# EasyEDA schematic SCH_ymu762-1_2022-05-05.json
TITLE: Sheet_1; REV: 1.0; Date: 2021-11-16; Sheet: 1/1; Company: Your Company
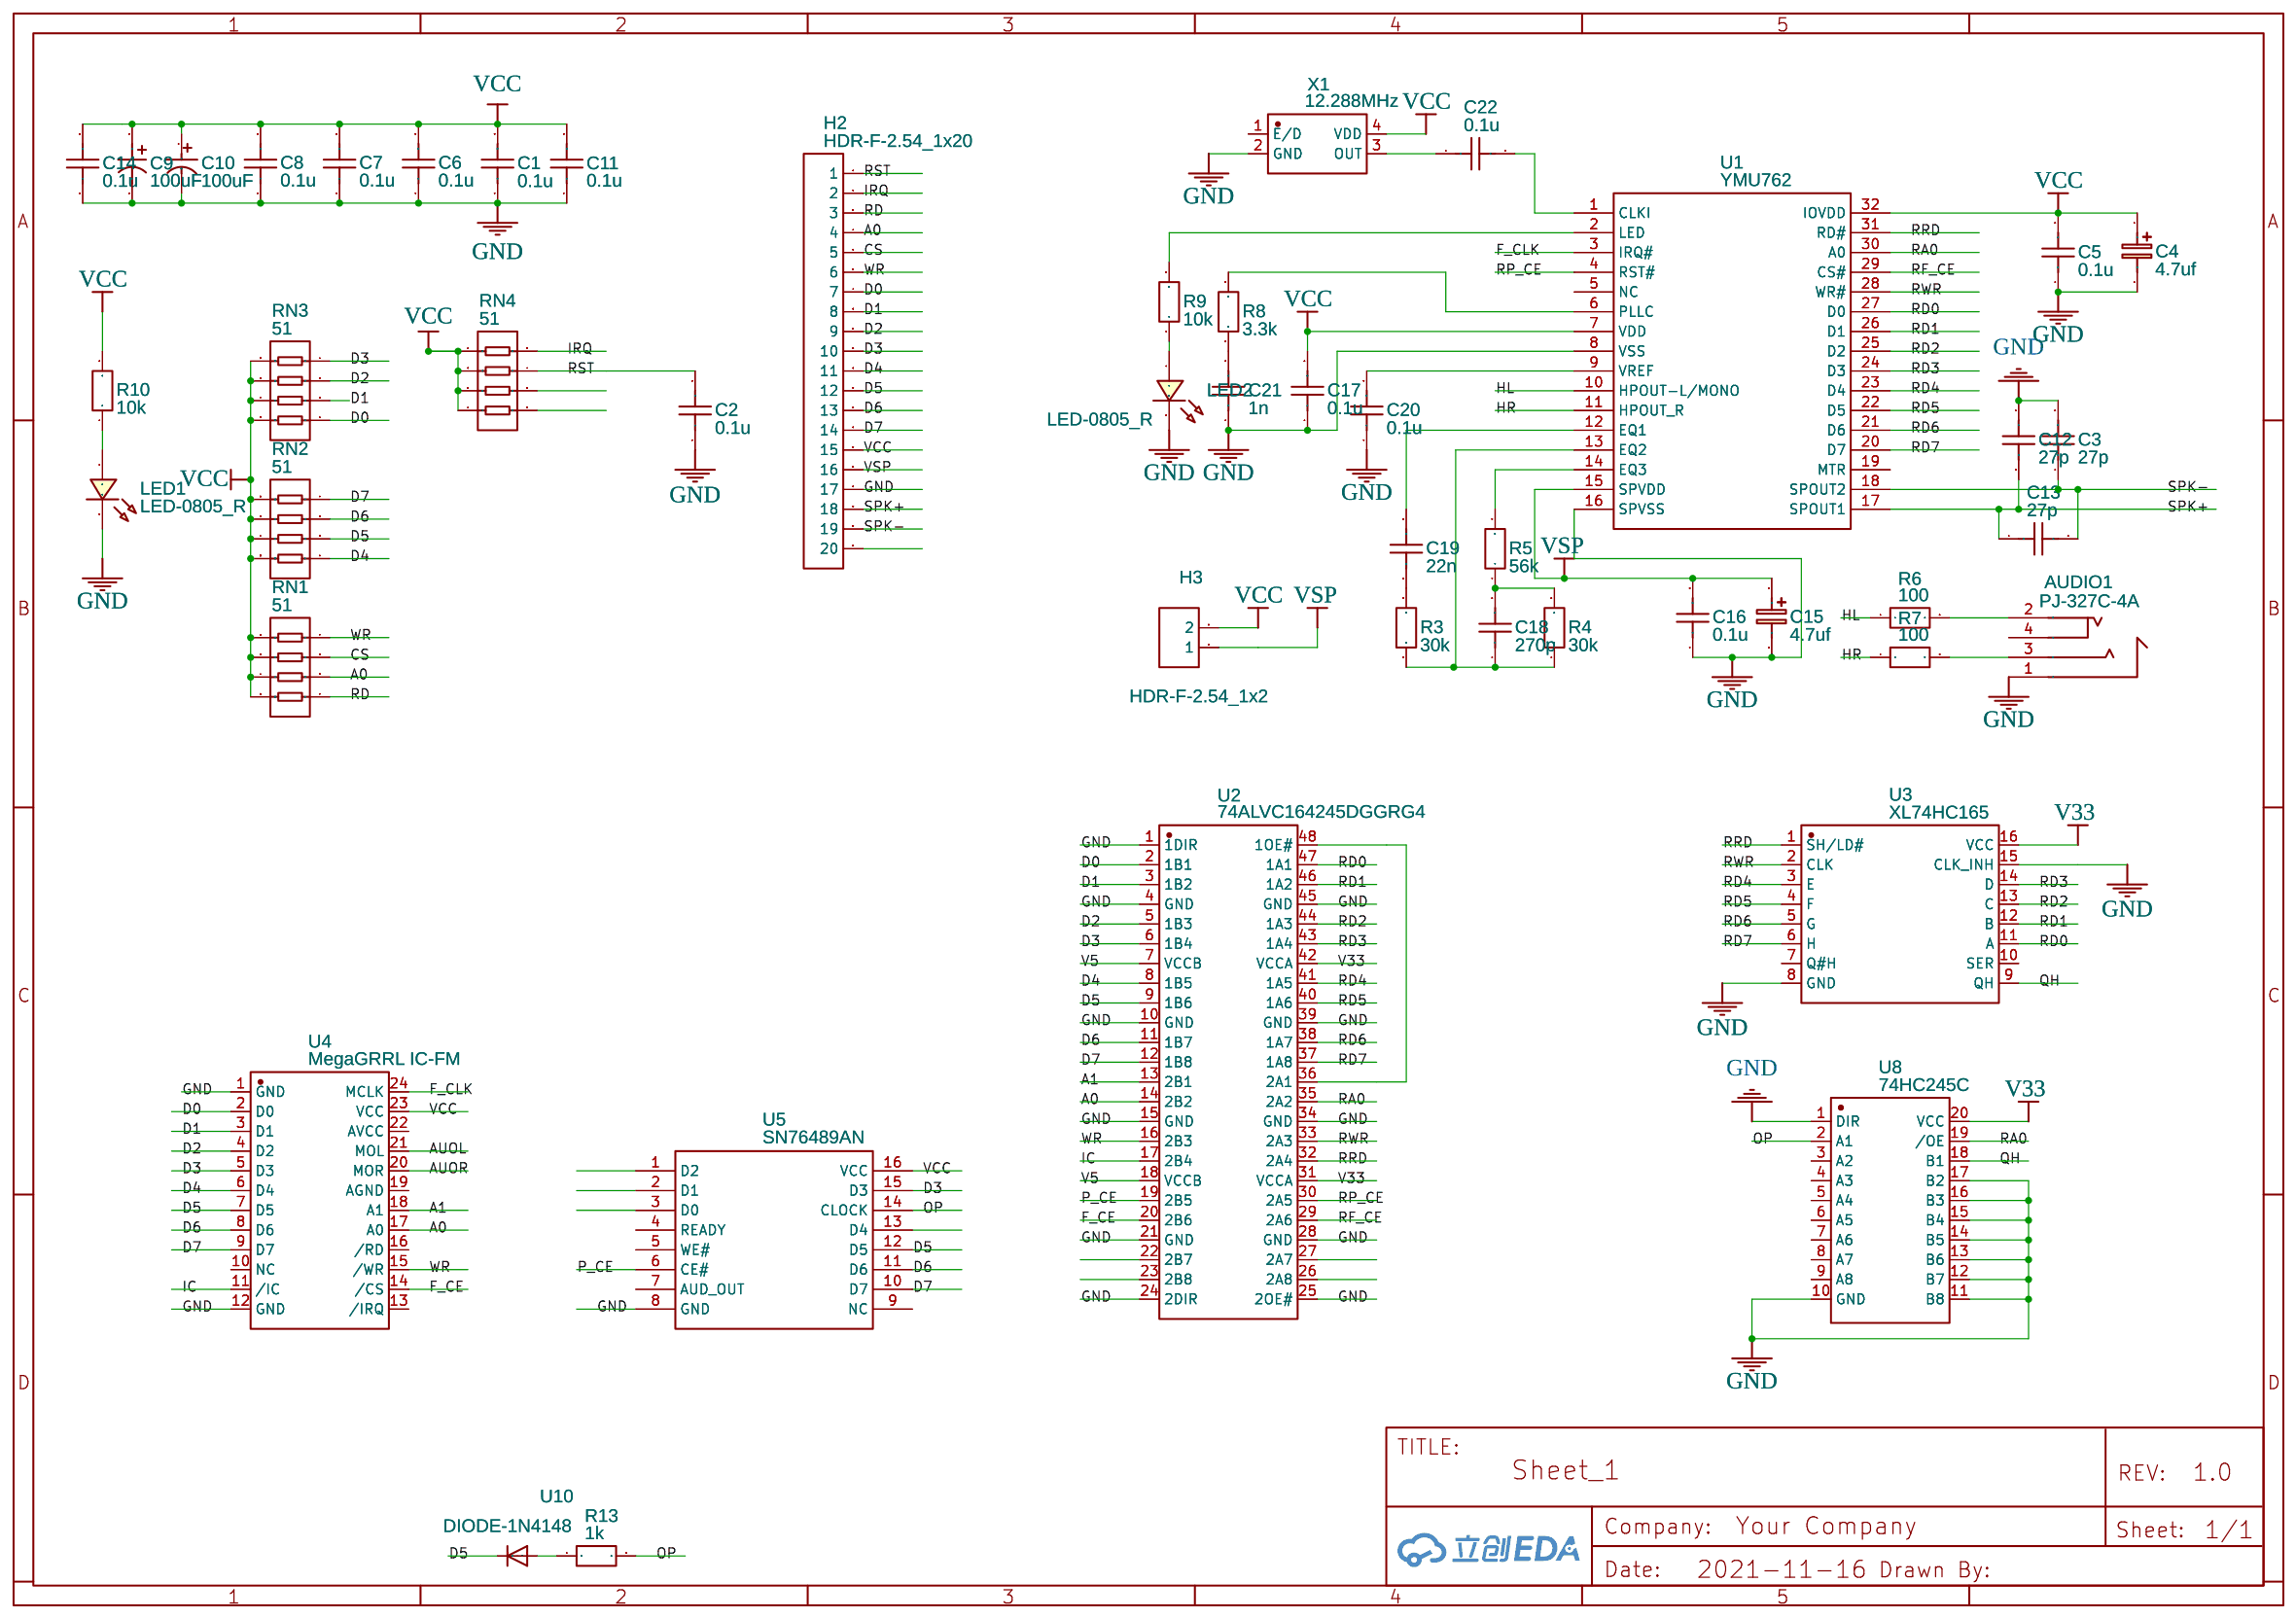
[diagram p0: schematic sheet]

## Parts
AUDIO1  PJ-327C-4A  [AUDIO-SMD_PJ-327C-4A]
C1  0.1u  [C0805]
C2  0.1u  [C0805]
C3  27p  [C0805]
C4  4.7uf  [C1206]
C5  0.1u  [C0805]
C6  0.1u  [C0805]
C7  0.1u  [C0805]
C8  0.1u  [C0805]
C9  100uF  [CAP-SMD_L6.6-W6.6]
C10  100uF  [CAP-TH_BD8.0-P3.50-D0.6-FD]
C11  0.1u  [C0805]
C12  27p  [C0805]
C13  27p  [C0805]
C14  0.1u  [C0805]
C15  4.7uf  [C1206]
C16  0.1u  [C0805]
C17  0.1u  [C0805]
C18  270p  [C0805]
C19  22n  [C0805]
C20  0.1u  [C0805]
C21  1n  [C0805]
C22  0.1u  [C0805]
H2  HDR-F-2.54_1x20  [HDR-F-2.54_1X20]
H3  HDR-F-2.54_1x2  [JP]
LED1  LED-0805_R  [LED0805_RED]
LED2  LED-0805_R  [LED0805_RED]
R3  30k  [R0805]
R4  30k  [R0805]
R5  56k  [R0805]
R6  100  [R0805]
R7  100  [R0805]
R8  3.3k  [R0805]
R9  10k  [R0805]
R10  10k  [R0805]
R13  1k  [R0805]
RN1  51  [RES-ARRAY-SMD_8P-L3.2-W1.6-P0.80-BL-1]
RN2  51  [RES-ARRAY-SMD_8P-L3.2-W1.6-P0.80-BL-1]
RN3  51  [RES-ARRAY-SMD_8P-L3.2-W1.6-P0.80-BL-1]
RN4  51  [RES-ARRAY-SMD_8P-L3.2-W1.6-P0.80-BL-1]
U1  YMU762  [C-PK32QP-2]
U2  74ALVC164245DGGRG4  [TSSOP-48_L12.5-W6.1-P0.50-LS8.1-BL]
U3  XL74HC165  [SOP-16_L9.9-W3.9-P1.27-LS6.1-BL]
U4  MegaGRRL IC-FM  [DIP-24_L32.0-W13.8-P2.54-LS15.6-BL]
U5  SN76489AN  [DIP-16_L20.4-W5.8-P2.54-LS7.6-BL]
U8  74HC245C  [TSSOP-20_L6.5-W4.4-P0.65-LS6.4-BL]
U10  DIODE-1N4148  [LL34-F]
X1  12.288MHz  [OSC-SMD_4P-L7.0-W5.0-BL]

## Library data of the parts
AUDIO1 = PJ-327C-4A: Supplier: LCSC; Manufacturer: HRO; Contributor: LCSC; Supplier Part: C145813
C1-C3 C5-C8 C11-C14 C16-C22 = C_0805_US: Contributor: LCEDA_Lib
C4 C15 = C_Tan_SMD_A_EU: Contributor: LCEDA_Lib
C9 = RVT100UF35V67RV0034: Supplier: LCSC; Supplier Part: C2836442; Manufacturer: KNSCHA(科尼盛); JLCPCB Part Class: Extended Part; Contributor: LCSC
C10 = 63V 100uF 8X12: Supplier: LCSC; Manufacturer: ValuePro; Supplier Part: C2772
H2 = HDR-F-2.54_1x20: Supplier Part: C50984; Supplier: LCSC; Contributor: LCEDA_Lib
H3 = HDR-F-2.54_1x2: Supplier Part: C49661; Supplier: LCSC; Contributor: LCEDA_Lib
LED1 LED2 = LED-0805_R: Manufacturer: EVERLIGHT(台湾亿光); Manufacturer Part: 17-21SURC/S530-A3/TR8; Supplier Part: C72037; Contributor: LCEDA_Lib
R3-R10 R13 = R_0805_EU: Contributor: LCEDA_Lib
RN1-RN4 = YC164-JR-0751RL: Supplier: LCSC; Supplier Part: C13474; Manufacturer: YAGEO; Contributor: LCSC; JLCPCB Part Class: Extended Part
U1 = YMU762: Contributor: re1mu
U2 = 74ALVC164245DGGRG4: Supplier: LCSC; Supplier Part: C2677427; Manufacturer: TI(德州仪器); Contributor: LCSC; JLCPCB Part Class: Extended Part
U3 = XL74HC165: Supplier: LCSC; Supplier Part: C609780; Manufacturer: XINLUDA; Contributor: LCSC; JLCPCB Part Class: Extended Part
U4 = MegaGRRL IC-FM: Supplier Part: C707077; Manufacturer: YAMAHA; Manufacturer Part: YM2612; Contributor: Denjhang; JLCPCB SMD: Yes; SMT Type: Extend
U5 = SN76489AN: Manufacturer: Texas Instruments; Contributor: re1mu
U8 = 74HC245C: Supplier: LCSC; Manufacturer: FM; Supplier Part: C126198; JLCPCB Part Class: Extended Part
U10 = DIODE-1N4148: null
X1 = OT705012.288MJBA4SL: Supplier: LCSC; Supplier Part: C669092; Manufacturer: Yangxing Tech; Contributor: LCSC

## Nets
GND: AUDIO1.1 C1.1 C2.1 C3.2 C4.2 C5.1 C6.1 C7.1 C8.1 C9.2 C10.2 C11.1 C12.1 C14.1 C15.2 C16.1 C17.1 C20.1 C21.1 H2.17 LED1.2 LED2.2 U1.8(VSS) U1.16(SPVSS) U2.1(1DIR) U2.4(GND) U2.10(GND) U2.15(GND) U2.21(GND) U2.24(2DIR) U2.25(2OE#) U2.28(GND) U2.34(GND) U2.39(GND) U2.45(GND) U3.8(GND) U3.15(CLK INH) U4.1(GND) U4.12(GND) U5.8(GND) U8.1(DIR) U8.10(GND) U8.11(B8) U8.12(B7) U8.13(B6) U8.14(B5) U8.15(B4) U8.16(B3) U8.17(B2) X1.2(GND)
V5: U2.7(VCCB) U2.18(VCCB)
V33: U2.31(VCCA) U2.42(VCCA) U3.16(VCC) U8.20(VCC)
VCC: C1.2 C4.1 C5.2 C6.2 C7.2 C8.2 C9.1 C10.1 C11.2 C14.2 C17.2 H2.15 H3.2 R10.2 RN1.5 RN1.6 RN1.7 RN1.8 RN2.5 RN2.6 RN2.7 RN2.8 RN3.5 RN3.6 RN3.7 RN3.8 RN4.1 RN4.2 RN4.3 RN4.4 U1.7(VDD) U1.32(IOVDD) U4.23(VCC) U5.16(VCC) X1.4(VDD)
A0: H2.4 RN1.2 U2.14(2B2) U4.17(A0)
A1: U2.13(2B1) U4.18(A1)
AUOL: U4.21(MOL)
AUOR: U4.20(MOR)
CS: H2.5 RN1.3
D0: H2.7 RN3.1 U2.2(1B1) U4.2(D0)
D1: H2.8 RN3.2 U2.3(1B2) U4.3(D1)
D2: H2.9 RN3.3 U2.5(1B3) U4.4(D2)
D3: H2.10 RN3.4 U2.6(1B4) U4.5(D3) U5.15(D3)
D4: H2.11 RN2.1 U2.8(1B5) U4.6(D4)
D5: H2.12 RN2.2 U2.9(1B6) U4.7(D5) U5.12(D5) U10.1(C)
D6: H2.13 RN2.3 U2.11(1B7) U4.8(D6) U5.11(D6)
D7: H2.14 RN2.4 U2.12(1B8) U4.9(D7) U5.10(D7)
F_CE: U2.20(2B6) U4.14(/CS)
F_CLK: U1.3(IRQ#) U4.24(MCLK)
HL: R6.1 U1.10(HPOUT-L/MONO)
HR: R7.1 U1.11(HPOUT_R)
IC: U2.17(2B4) U4.11(/IC)
IRQ: H2.2 RN4.8
OP: R13.2 U5.14(CLOCK) U8.2(A1)
P_CE: U2.19(2B5) U5.6(CE#)
QH: U3.9(QH) U8.18(B1)
RA0: U1.30(A0) U2.35(2A2) U8.19(/OE)
RD: H2.3 RN1.1
RD0: U1.27(D0) U2.47(1A1) U3.11(A)
RD1: U1.26(D1) U2.46(1A2) U3.12(B)
RD2: U1.25(D2) U2.44(1A3) U3.13(C)
RD3: U1.24(D3) U2.43(1A4) U3.14(D)
RD4: U1.23(D4) U2.41(1A5) U3.3(E)
RD5: U1.22(D5) U2.40(1A6) U3.4(F)
RD6: U1.21(D6) U2.38(1A7) U3.5(G)
RD7: U1.20(D7) U2.37(1A8) U3.6(H)
RF_CE: U1.29(CS#) U2.29(2A6)
RP_CE: U1.4(RST#) U2.30(2A5)
RRD: U1.31(RD#) U2.32(2A4) U3.1(SH/LD#)
RST: C2.2 H2.1 RN4.7
RWR: U1.28(WR#) U2.33(2A3) U3.2(CLK)
SPK+: C12.2 C13.1 H2.18 U1.17(SPOUT1)
SPK-: C3.1 C13.2 H2.19 U1.18(SPOUT2)
VSP: C15.1 C16.2 H2.16 H3.1 U1.15(SPVDD)
WR: H2.6 RN1.4 U2.16(2B3) U4.15(/WR)
Net-(AUDIO1-2): AUDIO1.2 R6.2
Net-(AUDIO1-3): AUDIO1.3 R7.2
Net-(C18-1): C18.1 R3.1 R4.1 U1.13(EQ2)
Net-(C18-2): C18.2 R4.2 R5.1
Net-(C19-1): C19.1 U1.12(EQ1)
Net-(C19-2): C19.2 R3.2
Net-(C20-2): C20.2 U1.9(VREF)
Net-(C21-2): C21.2 R8.1
Net-(C22-1): C22.1 X1.3(OUT)
Net-(C22-2): C22.2 U1.1(CLKI)
Net-(LED1-1): LED1.1 R10.1
Net-(LED2-1): LED2.1 R9.1
Net-(R5-2): R5.2 U1.14(EQ3)
Net-(R8-2): R8.2 U1.6(PLLC)
Net-(R9-2): R9.2 U1.2(LED)
Net-(R13-1): R13.1 U10.2(A)
Net-(U2-36): U2.36(2A1) U2.48(1OE#)

Not connected (* = marked no-connect by the designer): AUDIO1 4; H2 20; RN4 5 6; U1 5(NC) 19(MTR); U2 22(2B7) 23(2B8) 26(2A8) 27(2A7); U3 7(Q#H) 10(SER); U4 10(NC) 13(/IRQ) 16(/RD) 19(AGND) 22(AVCC); U5 1(D2) 2(D1) 3(D0) 4(READY) 5(WE#) 7(AUD OUT) 9(NC) 13(D4); U8 3(A2) 4(A3) 5(A4) 6(A5) 7(A6) 8(A7) 9(A8); X1 1(E/D)
